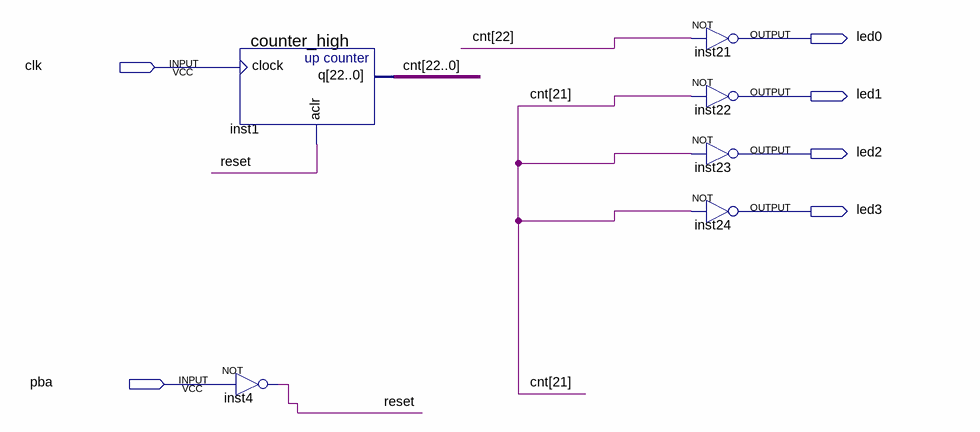
[diagram p0: schematic sheet]
// Quartus schematic lab1.bdf as structural Verilog: 6 symbols, 6 pins
module lab1 (
  input  clk,
  input  pba,
  output led0,
  output led1,
  output led2,
  output led3
);

  wire reset;
  wire [22:0] cnt;

  counter_high inst1 (.clock(clk), .aclr(reset), .q(cnt));
  not inst4 (reset, pba);
  not inst21 (led0, cnt[22]);
  not inst22 (led1, cnt[21]);
  not inst23 (led2, cnt[21]);
  not inst24 (led3, cnt[21]);
endmodule
